# EAGLE design bf (EAGLE 9.6.2)
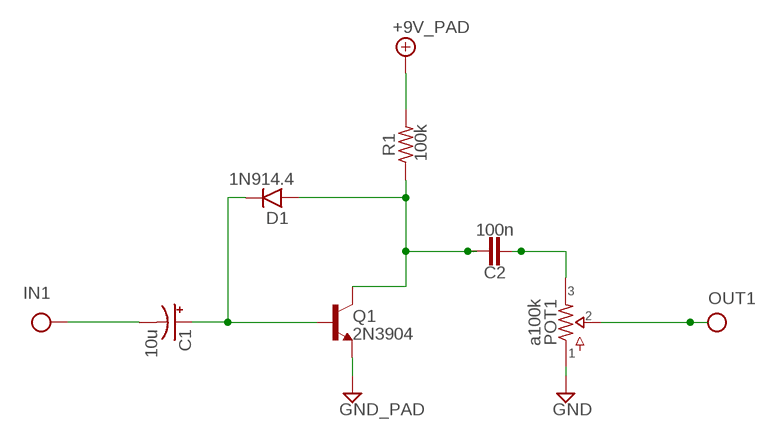
[diagram p0: schematic, sheet 1]

## Parts
C1  10u  050  [050_020]
C2  100n  CAP.2  [0.2".SML]
D1  1N914.4  [DO35-4]
GND2  GND_PAD  [SQUARE]
IN1  IN  [SQUARE]
OUT1  OUT  [SQUARE]
POT1  a100k  16MM.1  [16MM_B.MOUNT]
Q1  2N3904  [TO92-]
R1  100k  RESISTORS.4  [R0207/4]
V1  +9V_PAD  [SQUARE]

## Nets
+9V: R1.2 V1.1(+9V)
GND: GND2.1(GND) POT1.1 Q1.3(E)
IN: C1.- IN1.1(IN)
N$2: C1.+ D1.C Q1.2(B)
N$3: C2.1 D1.A Q1.1(C) R1.1
N$4: C2.2 POT1.3
OUT: OUT1.1(OUT) POT1.2

## Library data of the parts
C1 = gm-caps-electro-pol:050: 0.22 - 100uF Xicon values at Mouser.com: 10V: 10 - 100uF; 16V: 2.2 - 47uF; 25V: 0.47 - 47uF; 50V: 0.22 - 22uF
C2 = caps-film:CAP: For Ceramic, Film, MLCC caps
D1 = gm-diodes:1N914: Fast Switching Diode DO-35 glass case a.k.a. 1N4148
GND2 = supply pins:GND_PAD: Ground use this to hook up ground connections throughout a schematic instead of running wire automatically labels the net "GND"
IN1 = supply pins:IN: Input obsolete: use Mark instead and label net schematic input label without circuit board terminal/pad labels net "IN" provided as complement to OUT (rarely used)
OUT1 = supply pins:OUT: Output obsolete: use Mark instead and label net output label without circuit board terminal/pad commonly used as output label on 2nd lug of a potentiometer
POT1 = potentiometers:16MM: 16mm Poteniometers
Q1 = gm-trans:2N3904: NPN Transistor
R1 = resistors:RESISTORS
V1 = supply pins:+9V_PAD: +9V Voltage Supply use this to hook up +9v throughout a schematic instead of running wire automatically labels the net "+9v"

## Board
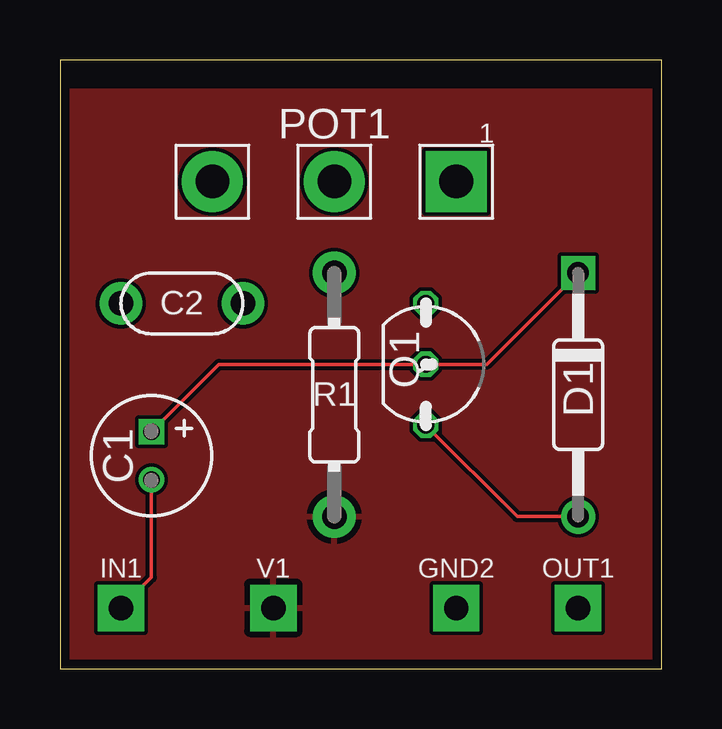
[diagram p1: board, top side]
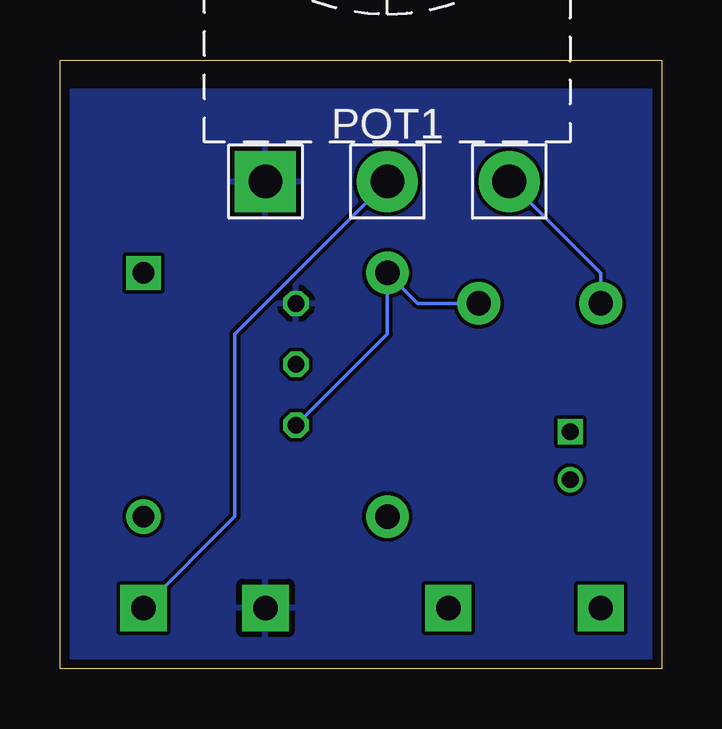
[diagram p2: board, bottom side, seen from below]

Size 25.07 x 25.39 mm. Coordinates in mm from the lower left corner, seen from the top.
Outline: 0,0 25.07,0 25.07,25.39 0,25.39 0,0
Copper layers (1*16): Top 0.035559375mm / dielectric 1.6mm / Bottom 0.035559375mm
Design rules "oshpark-2layer": minimum track width 6mil, minimum drill 10mil, track to track 6mil, track to pad 6mil, pad to pad 6mil, via to via 6mil, smd to smd 6mil, copper to edge 15mil, drill to drill 6mil, minimum pad ring 5mil, minimum via ring 5mil, stop-mask expansion 2.5mil, vias tented up to drill 0mil, thermal gap 10mil

### Footprints (pad centres in the part's own frame; a part is rotated, then mirrored left to right if it is on the bottom)
050_020 = drill 0.7 square: + -1,0 | drill 0.7: - 1,0
0.2".SML = drill 1.016 pad 1.778: 1 -2.54,0; 2 2.54,0
DO35-4 = drill 0.9 pad 1.422: A 5.08,0 | drill 0.9 pad 1.422 square: C -5.08,0
SQUARE = drill 1.016 pad 1.93 square: 1 0,0
16MM_B.MOUNT = drill 1.4 pad 2.54 square: 1 5.08,0 | drill 1.4 pad 2.54: 2 0,0; 3 -5.08,0
TO92- = drill 0.7 octagon: 1 2.54,0; 2 0,0; 3 -2.54,0
R0207/4 = drill 1.016 pad 1.778: 1 -5.08,0; 2 5.08,0

### Placement (x,y rotation side)
C1  3.81,8.89 270 top
C2  5.08,15.24 180 top
D1  21.59,11.43 270 top
GND2  16.51,2.54 0 top
IN1  2.54,2.54 0 top
OUT1  21.59,2.54 0 top
POT1  11.43,20.32 0 top
Q1  15.24,12.7 270 top
R1  11.43,11.43 270 top
V1  8.89,2.54 0 top

### Tracks (layer width: path | path; a pad name or v marks a point on that pad's centre or on a via)
+9V
  pour Top: 0,24.13 0,0 25.4,0 25.4,24.13
GND
  pour Bottom: 0,24.13 0,0 25.4,0 25.4,24.13
IN
  Top 0.152: IN1.1 3.81,3.81 C1.-
N$2
  Top 0.152: C1.+ 6.62,12.7 Q1.2 17.78,12.7 D1.C
N$3
  Top 0.152: Q1.1 19.05,6.35 D1.A
  Bottom 0.152: Q1.1 11.43,13.97 R1.1 10.16,15.24 C2.1
N$4
  Bottom 0.152: C2.2 2.54,16.51 POT1.3
OUT
  Bottom 0.152: POT1.2 17.78,13.97 17.78,6.35 OUT1.1